# EAGLE schematic mpu-9250 (EAGLE 7.2.0)
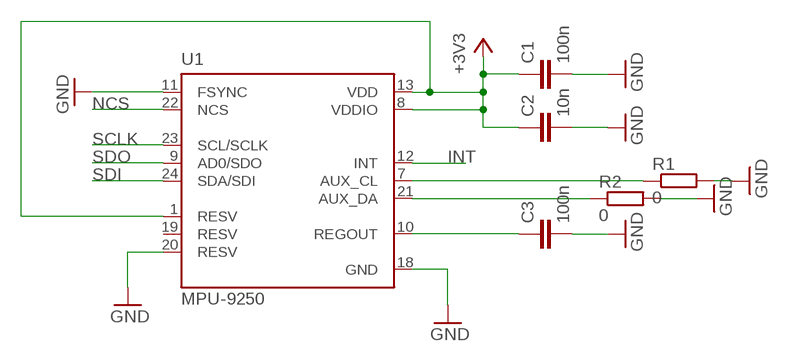
[diagram p0: schematic, sheet 1]

## Parts
C1  100n  C-EUC0805  [C0805]
C2  10n  C-EUC0805  [C0805]
C3  100n  C-EUC0805  [C0805]
R1  0  R-EU_R0805  [R0805]
R2  0  R-EU_R0805  [R0805]
U1  MPU-9250  [QFN40P300X300X105-25N]

## Nets
+3V3: C1.1 C2.1 U1.1(RESV) U1.8(VDDIO) U1.13(VDD)
GND: C1.2 C2.2 C3.2 R1.2 R2.2 U1.11(FSYNC) U1.18(GND) U1.20(RESV)
INT: U1.12(INT)
N$1: C3.1 U1.10(REGOUT)
N$2: R1.1 U1.7(AUX_CL)
N$3: R2.1 U1.21(AUX_DA)
NCS: U1.22(NCS)
SCLK: U1.23(SCL/SCLK)
SDI: U1.24(SDA/SDI)
SDO: U1.9(AD0/SDO)

## Power pins joined to a net without a drawn wire
RESV: U1.19(RESV)

## Library data of the parts
C1-C3 = rcl:C-EU: CAPACITOR, European symbol
R1 R2 = rcl:R-EU_: RESISTOR, European symbol
U1 = MPU-9250:MPU-9250: GYRO/ACCEL/COMPASS/9-AXIS; AVAILABILITY: Good; DESCRIPTION: SMD Gyroscope/Accelerometer/Magnetometer Sensor; 9-AXIS; MF: InvenSense; MP: MPU-9250; PACKAGE: QFN-24 InvenSense; PRICE: 6.71 USD